# EAGLE design fet-dd-charger-20mm-mk-1.1-bottom (EAGLE 7.5.0)
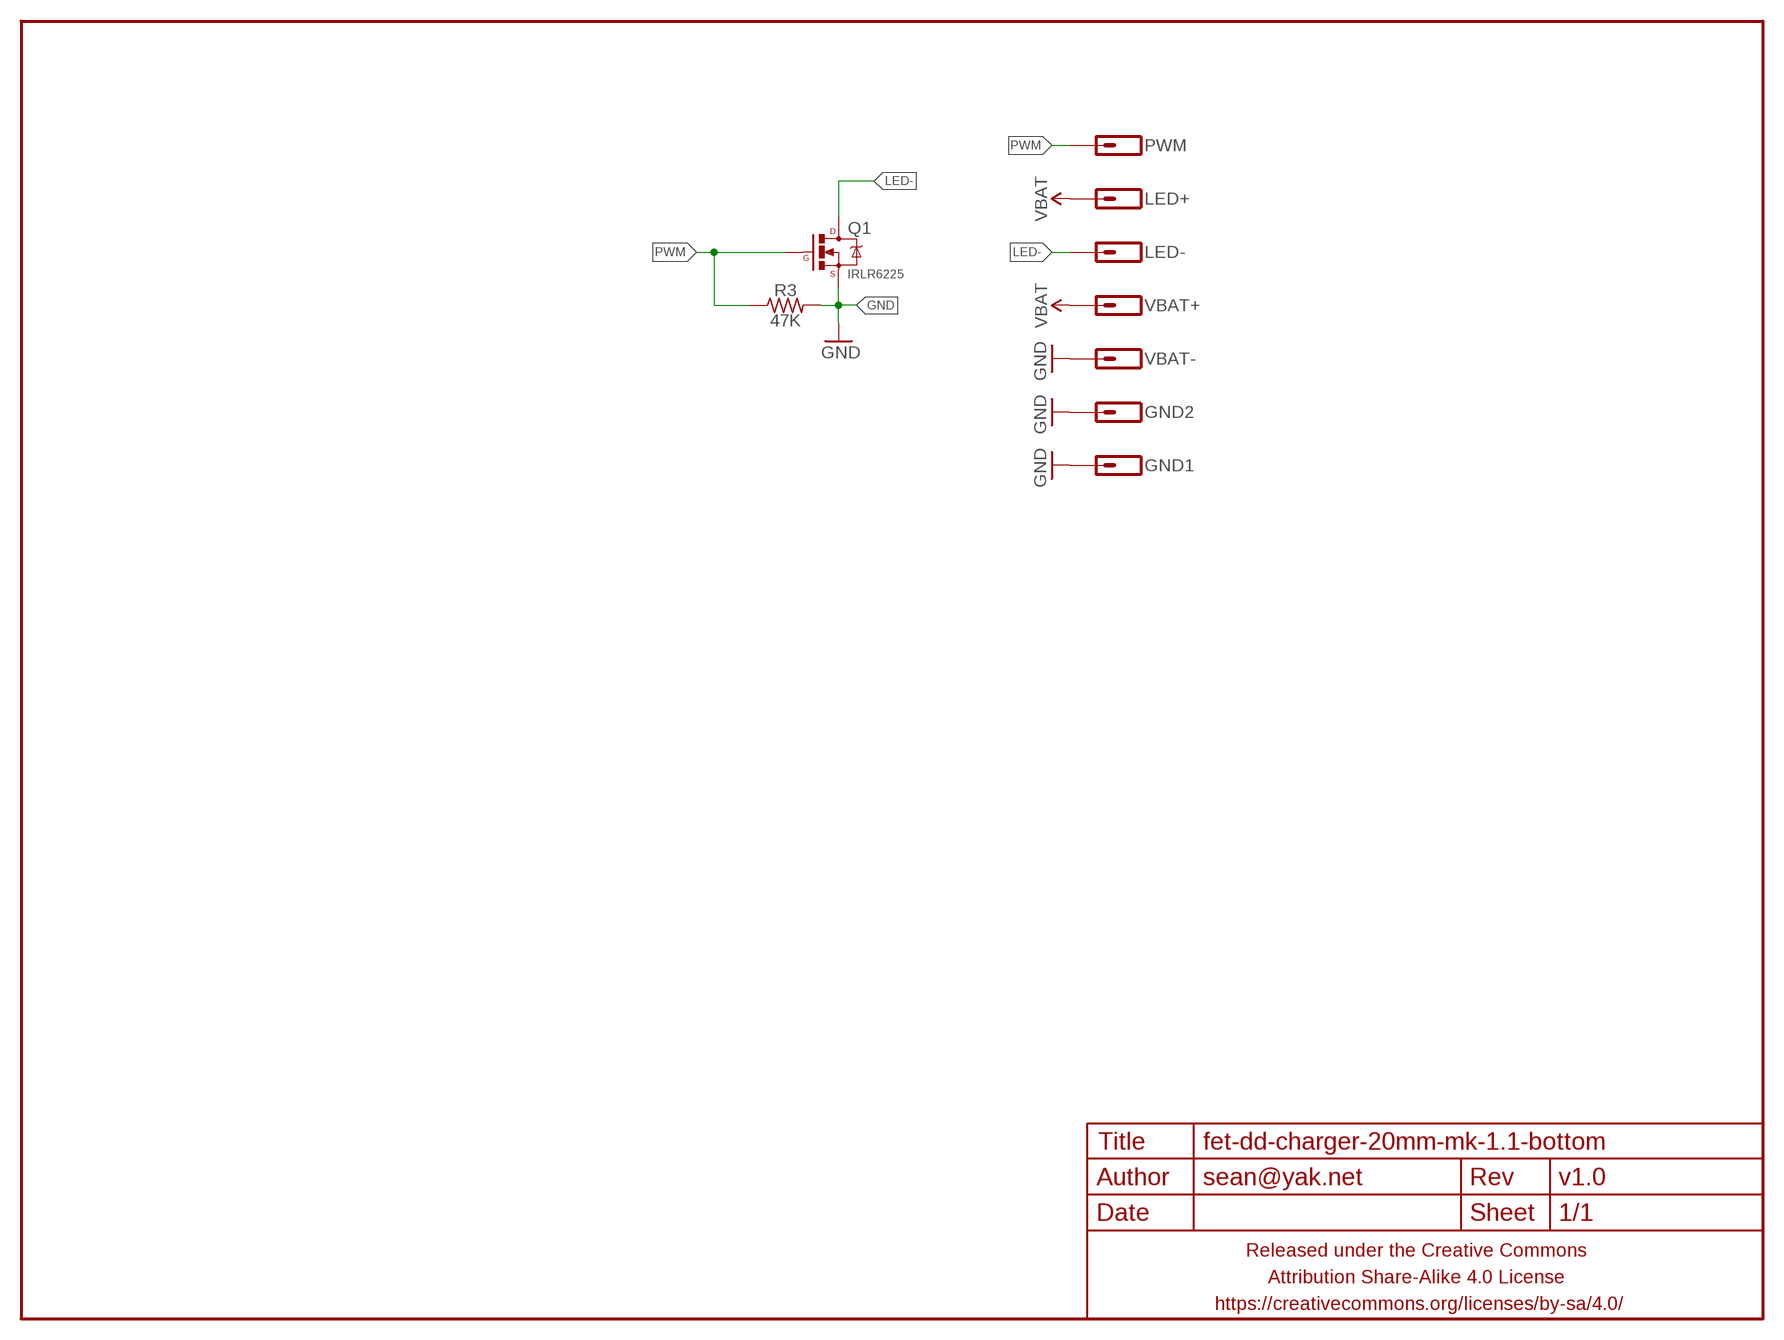
[diagram p0: schematic, sheet 1]

## Parts
FRAME1  FRAME-LETTERNO_PACKAGE  [DUMMY]
GND1  M01PTH_2MM  [1X01_2MM]
GND2  M01PTH_2MM  [1X01_2MM]
LED+  M01PTH_2MM  [1X01_2MM]
LED-  M01PTH_2MM  [1X01_2MM]
PWM  M01SMD-1MM-CIR  [1X01-SMD-1MM-DIA]
Q1  IRLR6225  MOSFET-NCHANNELSOT-223-CLOSER  [SOT223-CLOSER]
R3  47K  RESISTORR0603-TIGHTER  [R0603-TIGHTER]
VBAT+  M01NOSTOP-CANTSTOP-DONTKNOWHOWTOSTOP  [1X01_SMD_NOSTOP_NOSILK]
VBAT-  M01NOT-A-VIA-NOPE  [1X01_NOSILK_NOSTOP]

## Nets
GND: GND1.1 GND2.1 Q1.3(S) R3.2 VBAT-.P$1
LED-: LED-.1 Q1.2(D) Q1.4(D)
PWM: PWM.P$1 Q1.1(G) R3.1
VBAT: LED+.1 VBAT+.1

## Library data of the parts
FRAME1 = a_parts:FRAME-LETTER: Schematic Frame Standard 8.5x11 US Letter frame; DESIGNER: sean@yak.net; VERSION: v1.0
GND1 GND2 LED+ LED- PWM VBAT+ VBAT- = a_parts:M01: Header 1 Standard 1-pin 0.1" header. Use with straight break away headers (SKU : PRT-00116), right angle break away headers (PRT-00553), swiss pins (PRT-00743), machine pins (PRT-00117), and female headers (PRT-00115).
Q1 = a_parts:MOSFET-NCHANNEL: Common NMOSFET Parts MFG P/N Store ID Prod ID FDD8780 TRANS-09984 SI7820DN TRANS-11055 FDS6630A IC-08089 2N7002PW TRANS-11151 FQP30N06L COM-10213 TRANS-10060 BSS123LT1G TRANS-08345 BSS138 TRANS-00830 BS170 2N7000
R3 = a_parts:RESISTOR: RESISTOR, American symbol

## Board
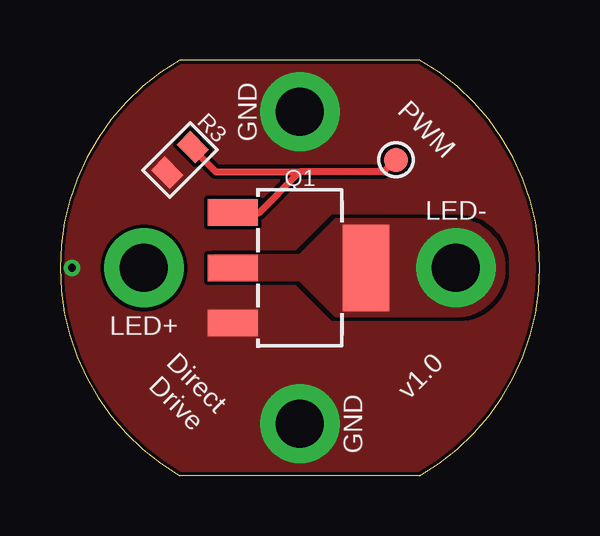
[diagram p1: board, top side]
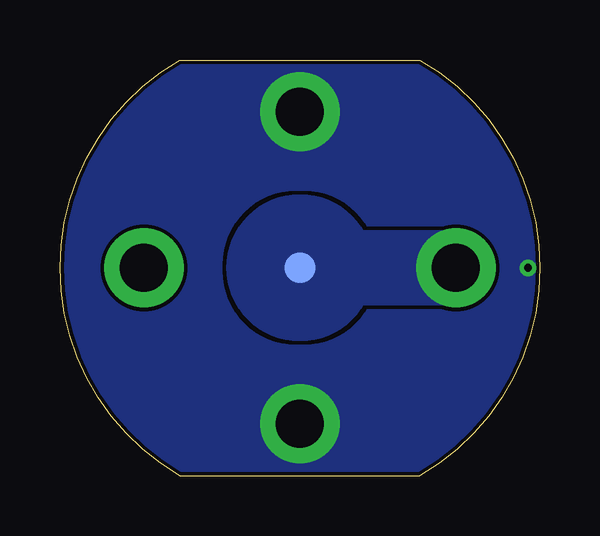
[diagram p2: board, bottom side, seen from below]

Size 20 x 17.32 mm. Coordinates in mm from the lower left corner, seen from the top.
Outline: 15,0 5,0 arc-120 5,17.32 15,17.32 arc-120 15,0
Copper layers (1*16): Top 0.0356mm / dielectric 1.5011mm / Bottom 0.0356mm
Design rules "LaenPCBOrder2": minimum track width 6mil, minimum drill 13mil, track to track 6mil, track to pad 6mil, pad to pad 6mil, via to via 6mil, smd to smd 6mil, copper to edge 6mil, drill to drill 6mil, minimum pad ring 7mil, minimum via ring 7mil, stop-mask expansion 3mil, vias tented up to drill 20mil, thermal gap 10mil

### Footprints (pad centres in the part's own frame; a part is rotated, then mirrored left to right if it is on the bottom)
1X01_2MM = drill 2 pad 3.302: 1 0,0
1X01-SMD-1MM-DIA = smd 1 x 1: P$1 0,0
SOT223-CLOSER = smd 1.1 x 2.1: 1 -2.3,-2.8; 2 0,-2.8; 3 2.3,-2.8 | smd 3.6 x 1.95: 4 0,2.75
R0603-TIGHTER = smd 0.8 x 1.1: 1 -0.75,0; 2 0.75,0
1X01_SMD_NOSTOP_NOSILK = smd 1.27 x 1.27: 1 0,0
1X01_NOSILK_NOSTOP = drill 0.33: P$1 0,0

### Placement (x,y rotation side)
FRAME1  0,-1.34 0 top
GND1  10,2.16 270 top
GND2  10,15.16 90 top
LED+  3.5,8.66 90 top
LED-  16.5,8.66 270 top
PWM  14,13.16 0 top
Q1  10,8.66 270 top
R3  5,13.16 225 top
VBAT+  10,8.66 0 bottom
VBAT-  0.5,8.66 0 top

### Tracks (layer width: path | path; a pad name or v marks a point on that pad's centre or on a via)
GND
  pour Bottom (isolate 0.152, rank 6, no thermals): 0,-1.34 20,-1.34 20,18.66 0,18.66
  pour Top (isolate 0.152, rank 6, no thermals): 20,-1.34 0,-1.34 0,18.66 20,18.66
LED-
  pour Top (isolate 0.152, rank 2, no thermals): 6.5,9.16 6.5,8.16 10,8.16 11.5,6.66 16.5,6.66 arc90 18.5,8.66 arc90 16.5,10.66 11.5,10.66 10,9.16
PWM
  Top 0.3: PWM.P$1 13.5,12.66 10,12.66 | Q1.1 8.3,10.96 10,12.66 | R3.1 5.53,13.63 6.5,12.66 10,12.66
VBAT
  pour Bottom (isolate 0.152, no thermals): 7,8.66 arc-180 13,8.66 arc-180
  pour Bottom (isolate 0.152, rank 2, no thermals): 10.5,10.16 3.5,10.16 2.5,9.16 2.5,8.16 3.5,7.16 10.5,7.16

### Text on the board
tNames: GND | Direct / Drive | GND